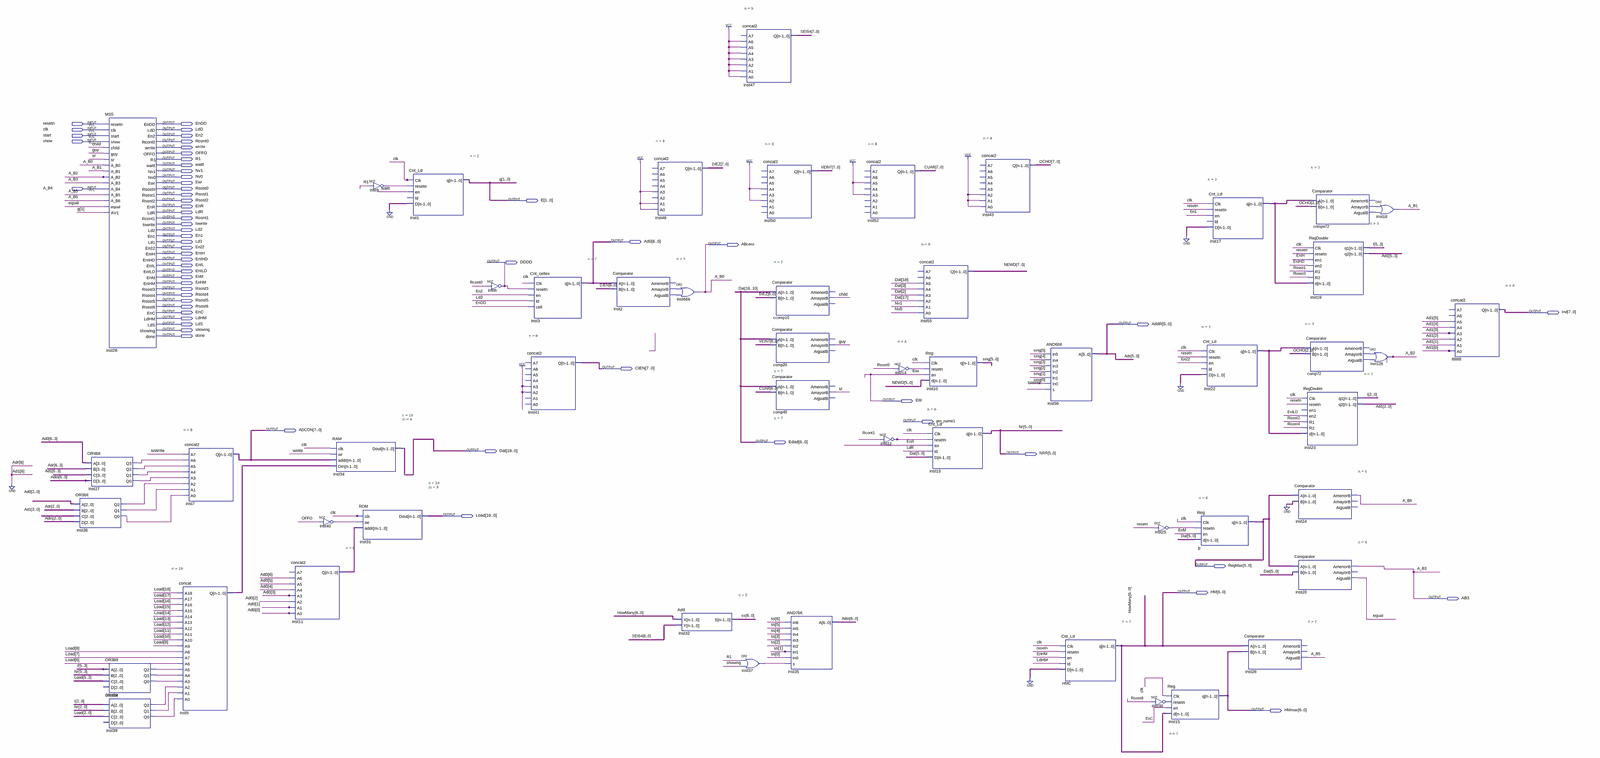
[diagram p0: schematic sheet, whole]
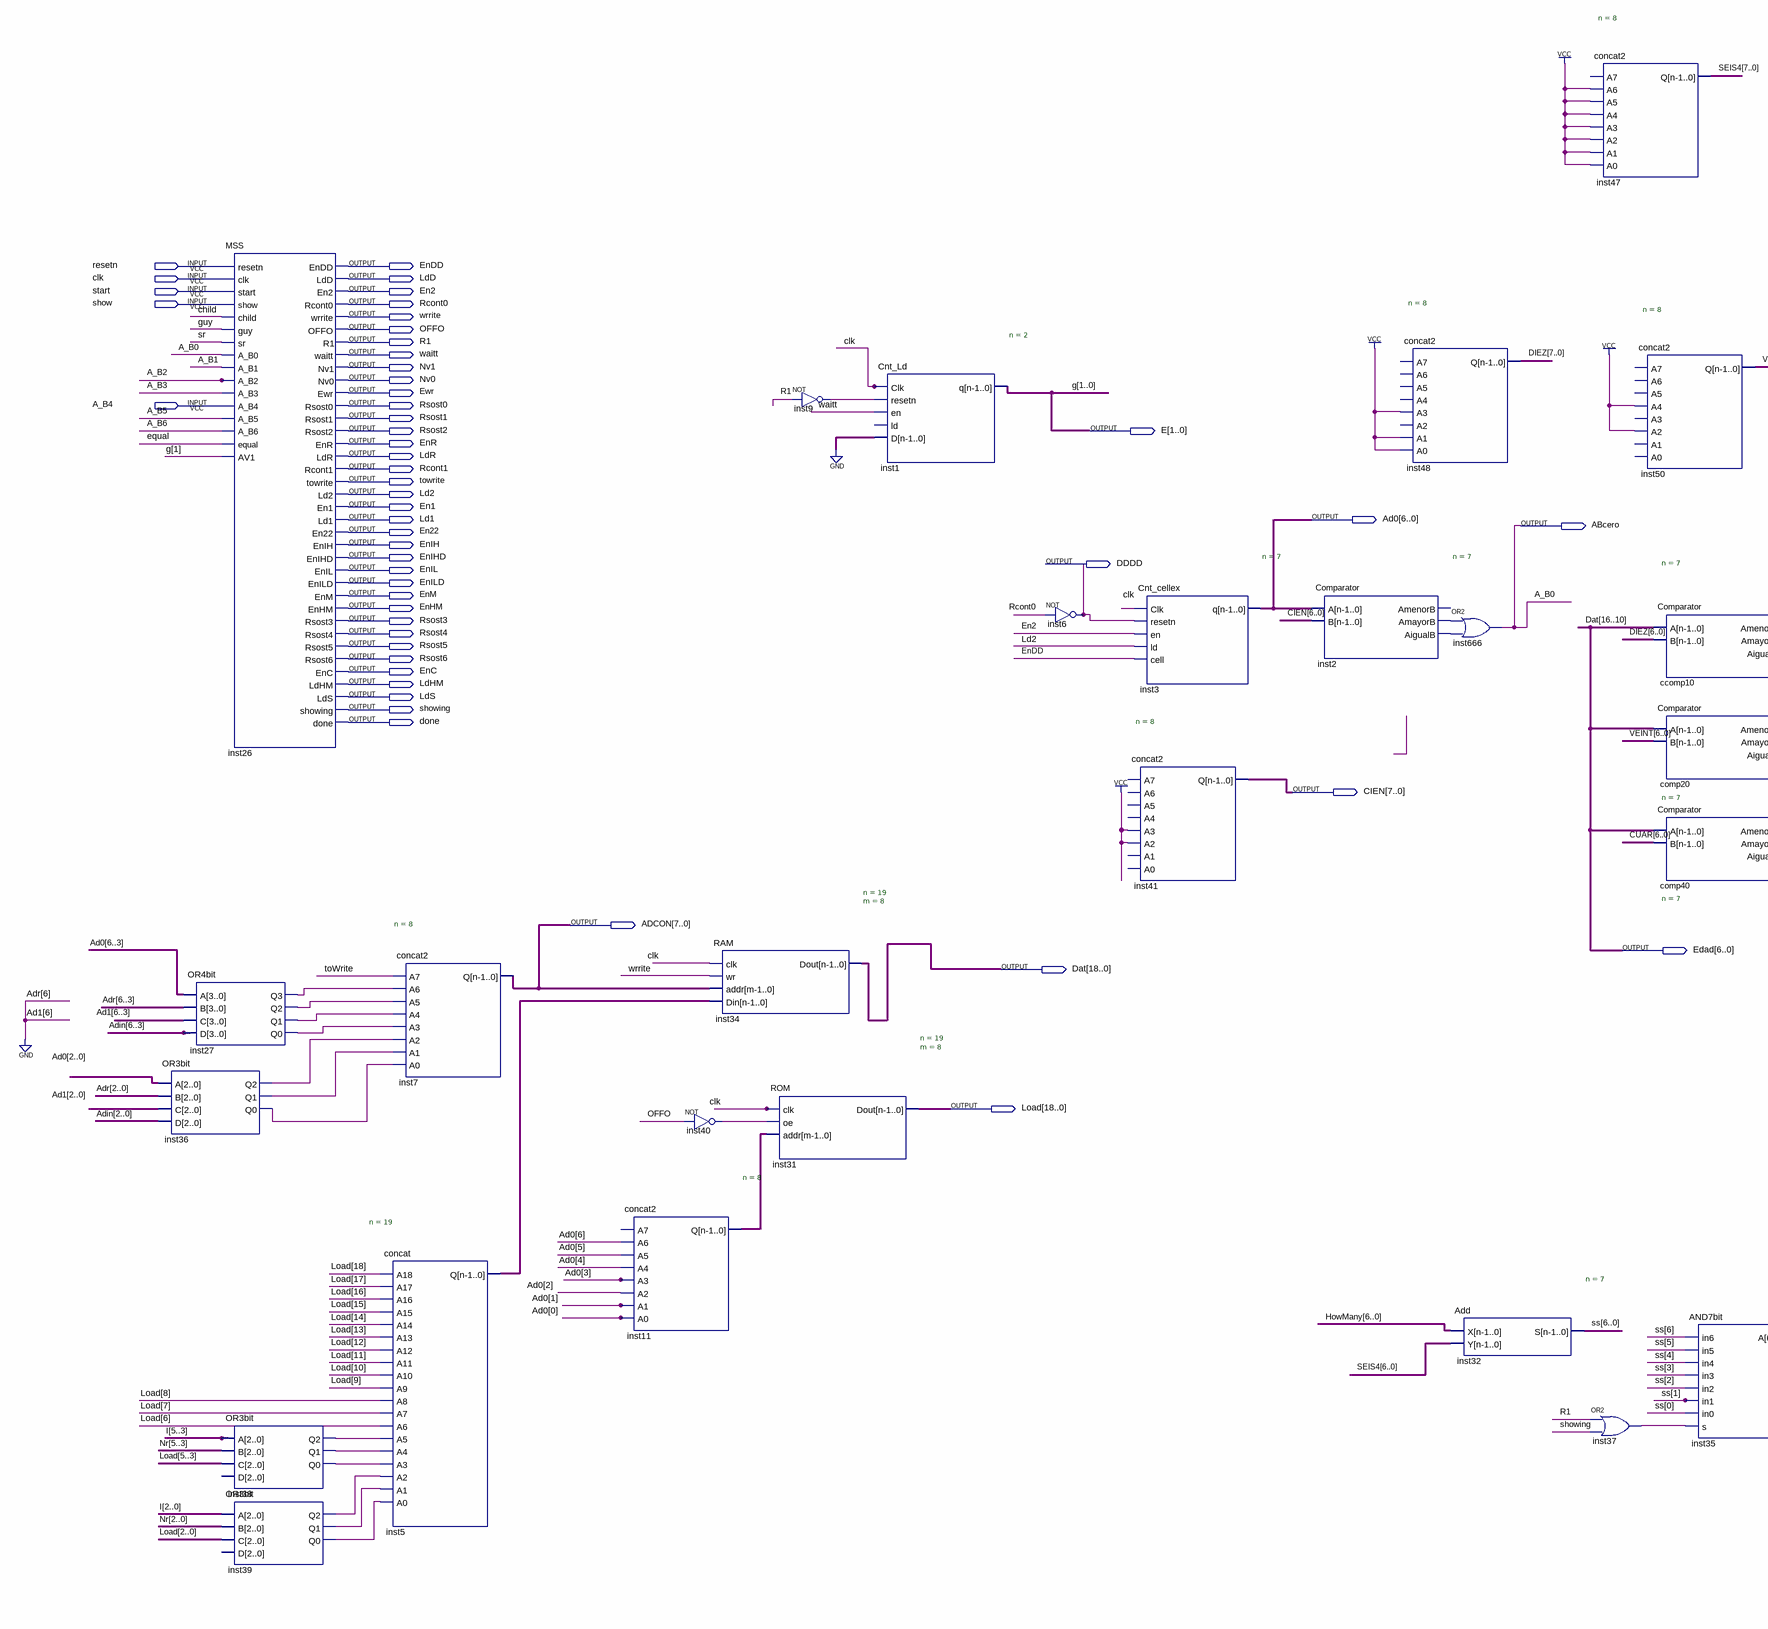
[diagram p1: schematic sheet, left part]
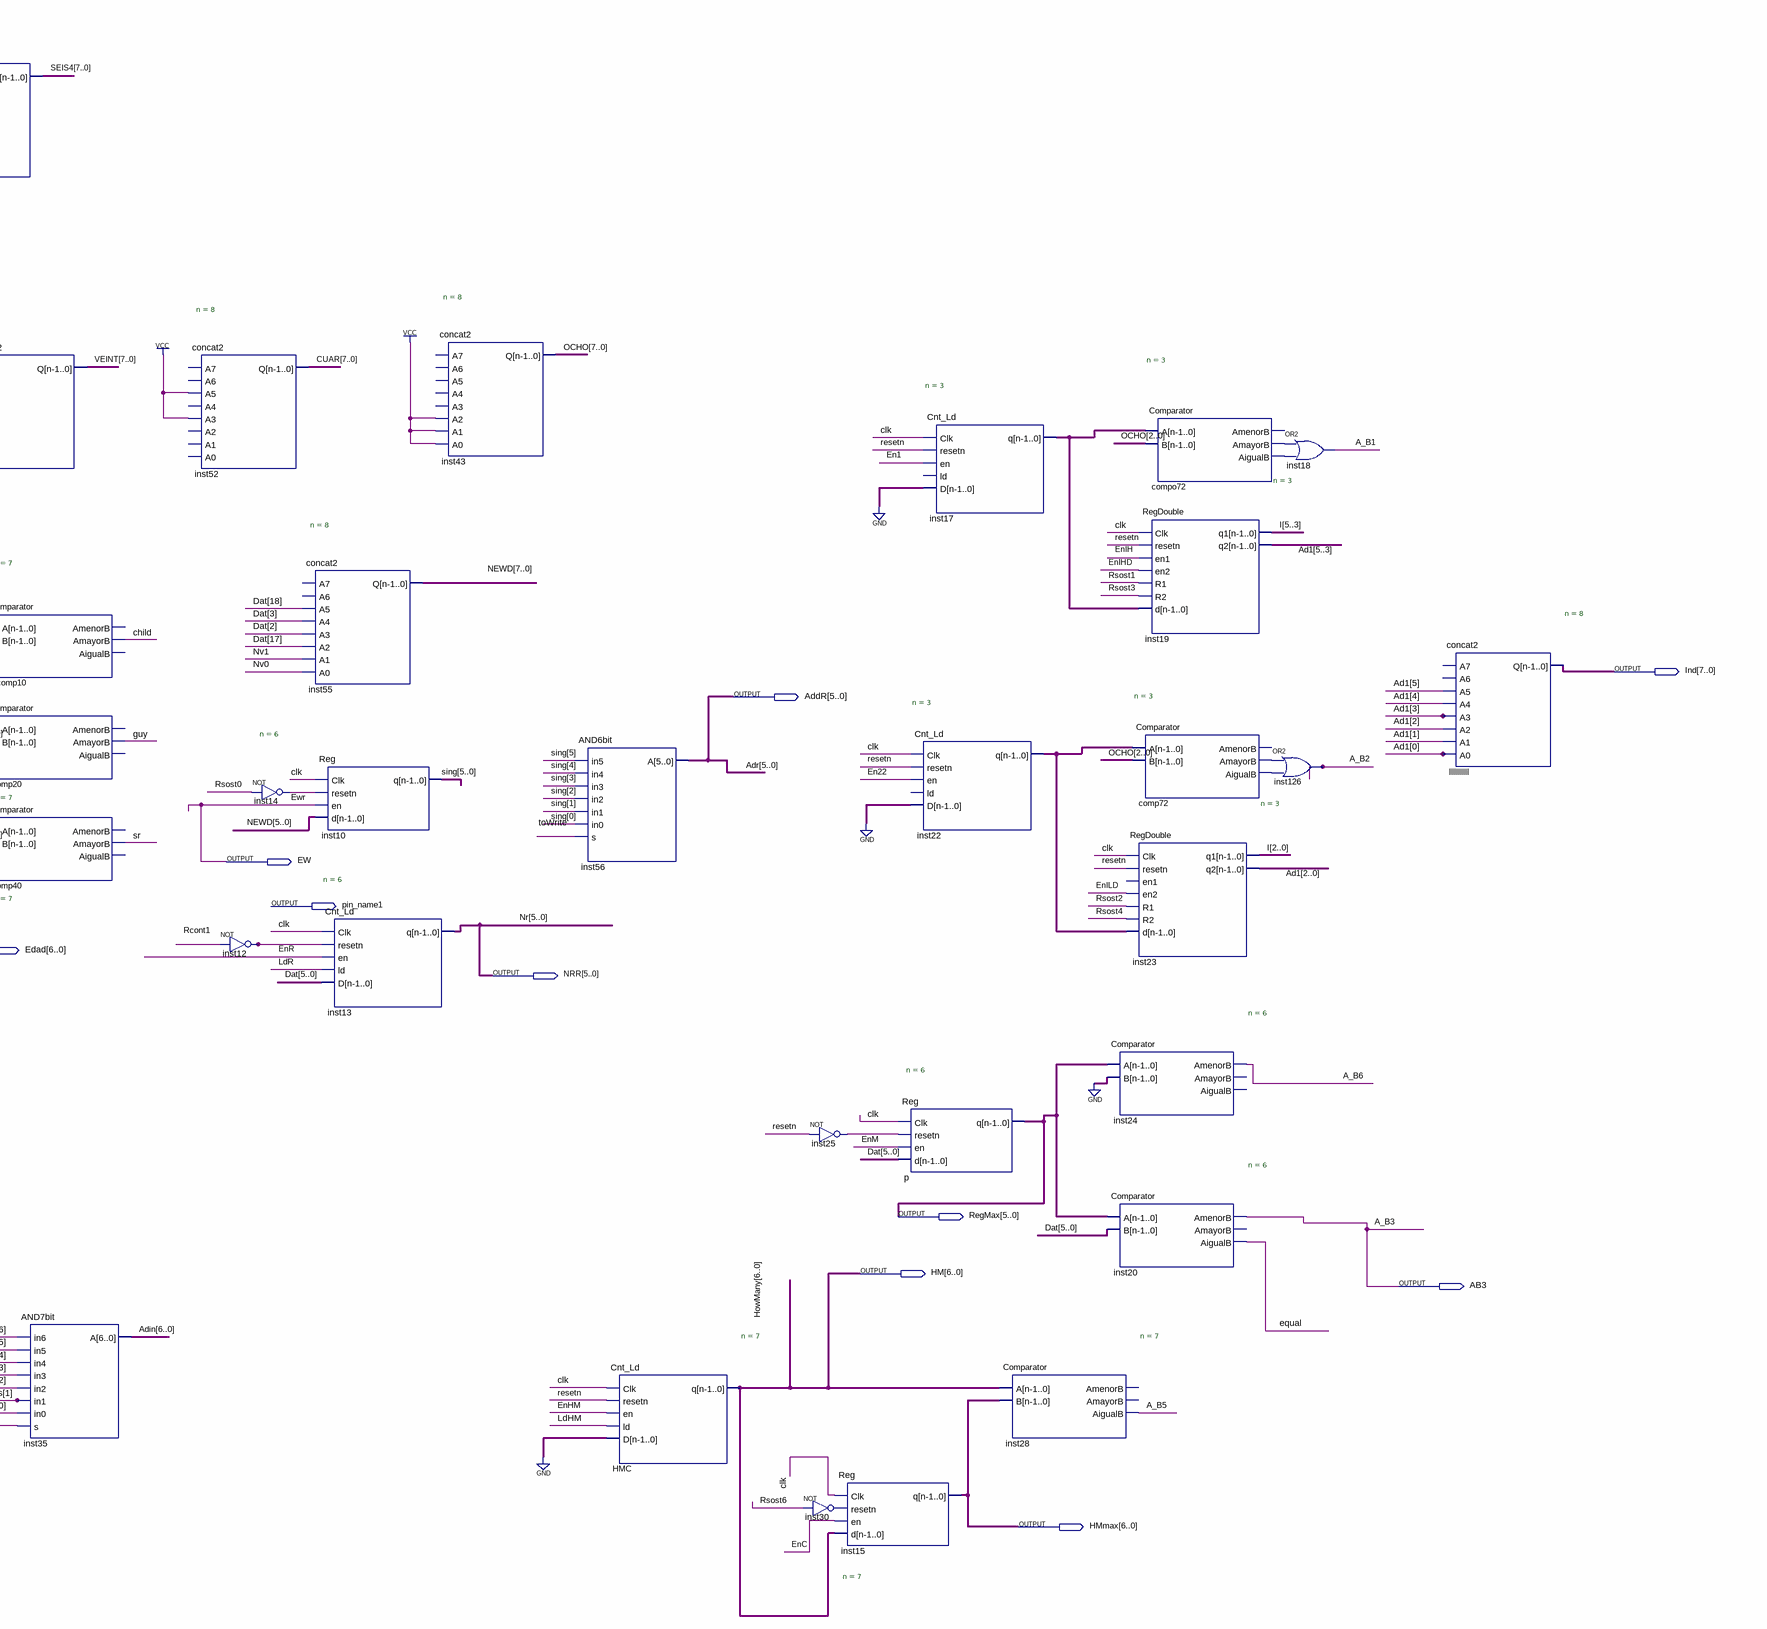
[diagram p2: schematic sheet, right part]
// Quartus schematic Block1.bdf as structural Verilog: 52 symbols, 60 pins
module Block1 (
  input  resetn,
  input  clk,
  input  start,
  input  show,
  input  A_B4,
  output EnDD,
  output LdD,
  output En2,
  output Rcont0,
  output wrrite,
  output OFFO,
  output R1,
  output waitt,
  output Nv1,
  output Nv0,
  output Ewr,
  output Rsost0,
  output Rsost1,
  output Rsost2,
  output [1:0] E,
  output EnR,
  output LdR,
  output Rcont1,
  output towrite,
  output Ld2,
  output En1,
  output Ld1,
  output [6:0] Ad0,
  output ABcero,
  output En22,
  output EnIH,
  output EnIHD,
  output DDDD,
  output EnIL,
  output EnILD,
  output EnM,
  output EnHM,
  output Rsost3,
  output Rsost4,
  output Rsost5,
  output Rsost6,
  output EnC,
  output [7:0] Ind,
  output LdHM,
  output LdS,
  output [5:0] AddR,
  output showing,
  output done,
  output [7:0] CIEN,
  output EW,
  output pin_name1,
  output [7:0] ADCON,
  output [6:0] Edad,
  output [18:0] Dat,
  output [5:0] NRR,
  output [18:0] Load,
  output [5:0] RegMax,
  output [6:0] HM,
  output AB3,
  output [6:0] HMmax
);

  wire A_B1, A_B2, A_B5, A_B6, child, comp72_aigualb, comp72_amayorb, compo72_aigualb, compo72_amayorb,
       equal, guy, inst2_aigualb, inst2_amayorb, inst9_out, inst12_out, inst14_out, inst25_out, inst27_q0,
       inst27_q1, inst27_q2, inst27_q3, inst30_out, inst36_q0, inst36_q1, inst36_q2, inst37_out, inst38_q0,
       inst38_q1, inst38_q2, inst39_q0, inst39_q1, inst39_q2, inst40_out, sr;
  wire [2:0] inst17_q, inst22_q;
  wire [5:0] Ad1, I, sing;
  wire [6:0] Adin, ss;
  wire [7:0] CUAR, DIEZ, inst11_q, NEWD, OCHO, SEIS4, VEINT;
  wire [18:0] inst5_q;

  OR3bit inst36 (
    .A(Ad0[2:0]), .B(AddR[2:0]), .C(Ad1[2:0]), .D(Adin[2:0]), .Q2(inst36_q2), .Q1(inst36_q1), .Q0(inst36_q0));
  OR4bit inst27 (
    .A(Ad0[6:3]), .B({1'b0, AddR[5:3]}), .C({1'b0, Ad1[5:3]}), .D(Adin[6:3]), .Q3(inst27_q3), .Q2(inst27_q2),
    .Q1(inst27_q1), .Q0(inst27_q0));
  MSS inst26 (
    .resetn(resetn), .clk(clk), .start(start), .show(show), .child(child), .guy(guy), .sr(sr), .A_B0(ABcero),
    .A_B1(A_B1), .A_B2(A_B2), .A_B3(AB3), .A_B4(A_B4), .A_B5(A_B5), .A_B6(A_B6), .equal(equal), .AV1(E[1]),
    .EnDD(EnDD), .LdD(LdD), .En2(En2), .Rcont0(Rcont0), .wrrite(wrrite), .OFFO(OFFO), .R1(R1), .waitt(waitt),
    .Nv1(Nv1), .Nv0(Nv0), .Ewr(EW), .Rsost0(Rsost0), .Rsost1(Rsost1), .Rsost2(Rsost2), .EnR(EnR), .LdR(LdR),
    .Rcont1(Rcont1), .towrite(towrite), .Ld2(Ld2), .En1(En1), .Ld1(Ld1), .En22(En22), .EnIH(EnIH),
    .EnIHD(EnIHD), .EnIL(EnIL), .EnILD(EnILD), .EnM(EnM), .EnHM(EnHM), .Rsost3(Rsost3), .Rsost4(Rsost4),
    .Rsost5(Rsost5), .Rsost6(Rsost6), .EnC(EnC), .LdHM(LdHM), .LdS(LdS), .showing(showing), .done(done));
  OR3bit inst38 (.A(I[5:3]), .B(NRR[5:3]), .C(Load[5:3]), .Q2(inst38_q2), .Q1(inst38_q1), .Q0(inst38_q0));  // open: D
  OR3bit inst39 (.A(I[2:0]), .B(NRR[2:0]), .C(Load[2:0]), .Q2(inst39_q2), .Q1(inst39_q1), .Q0(inst39_q0));  // open: D
  concat2 #(.n(8)) inst7 (
    .A7(towrite), .A6(inst27_q3), .A5(inst27_q2), .A4(inst27_q1), .A3(inst27_q0), .A2(inst36_q2),
    .A1(inst36_q1), .A0(inst36_q0), .Q(ADCON));
  concat #(.n(19)) inst5 (
    .A18(Load[18]), .A17(Load[17]), .A16(Load[16]), .A15(Load[15]), .A14(Load[14]), .A13(Load[13]),
    .A12(Load[12]), .A11(Load[11]), .A10(Load[10]), .A9(Load[9]), .A8(Load[8]), .A7(Load[7]), .A6(Load[6]),
    .A5(inst38_q2), .A4(inst38_q1), .A3(inst38_q0), .A2(inst39_q2), .A1(inst39_q1), .A0(inst39_q0),
    .Q(inst5_q));
  concat2 #(.n(8)) inst11 (
    .A6(Ad0[6]), .A5(Ad0[5]), .A4(Ad0[4]), .A3(Ad0[3]), .A2(Ad0[2]), .A1(Ad0[1]), .A0(Ad0[0]), .Q(inst11_q));  // open: A7
  RAM #(.n(19), .m(8)) inst34 (.clk(clk), .wr(wrrite), .addr(ADCON), .Din(inst5_q), .Dout(Dat));
  not inst40 (inst40_out, OFFO);
  ROM #(.n(19), .m(8)) inst31 (.clk(clk), .oe(inst40_out), .addr(inst11_q), .Dout(Load));
  not inst9 (inst9_out, R1);
  Cnt_Ld #(.n(2)) inst1 (.Clk(clk), .resetn(inst9_out), .en(waitt), .D(2'b00), .q(E));  // open: ld
  not inst6 (DDDD, Rcont0);
  concat2 #(.n(8)) inst41 (.A3(1'b1), .A2(1'b1), .Q(CIEN));  // open: A7, A6, A5, A4, A1, A0
  Cnt_cellex #(.n(7)) inst3 (.Clk(clk), .resetn(DDDD), .en(En2), .ld(Ld2), .\cell (EnDD), .q(Ad0));
  Comparator #(.n(7)) inst2 (
    .A(Ad0), .B(CIEN[6:0]), .AmayorB(inst2_amayorb), .AigualB(inst2_aigualb));  // open: AmenorB
  concat2 #(.n(8)) inst48 (.A3(1'b1), .A1(1'b1), .A0(1'b1), .Q(DIEZ));  // open: A7, A6, A5, A4, A2
  or inst666 (ABcero, inst2_amayorb, inst2_aigualb);
  Add #(.n(7)) inst32 (.X(HM), .Y(SEIS4[6:0]), .S(ss));
  concat2 #(.n(8)) inst47 (
    .A6(1'b1), .A5(1'b1), .A4(1'b1), .A3(1'b1), .A2(1'b1), .A1(1'b1), .A0(1'b1), .Q(SEIS4));  // open: A7
  concat2 #(.n(8)) inst50 (.A4(1'b1), .A2(1'b1), .Q(VEINT));  // open: A7, A6, A5, A3, A1, A0
  or inst37 (inst37_out, R1, showing);
  Comparator #(.n(7)) ccomp10 (.A(Dat[16:10]), .B(DIEZ[6:0]), .AmayorB(child));  // open: AmenorB, AigualB
  Comparator #(.n(7)) comp20 (.A(Dat[16:10]), .B(VEINT[6:0]), .AmayorB(guy));  // open: AmenorB, AigualB
  Comparator #(.n(7)) comp40 (.A(Dat[16:10]), .B(CUAR[6:0]), .AmayorB(sr));  // open: AmenorB, AigualB
  AND7bit inst35 (
    .in6(ss[6]), .in5(ss[5]), .in4(ss[4]), .in3(ss[3]), .in2(ss[2]), .in1(ss[1]), .in0(ss[0]),
    .s(inst37_out), .A(Adin));
  concat2 #(.n(8)) inst52 (.A5(1'b1), .A3(1'b1), .Q(CUAR));  // open: A7, A6, A4, A2, A1, A0
  not inst12 (inst12_out, Rcont1);
  not inst14 (inst14_out, Rsost0);
  concat2 #(.n(8)) inst55 (
    .A5(Dat[18]), .A4(Dat[3]), .A3(Dat[2]), .A2(Dat[17]), .A1(Nv1), .A0(Nv0), .Q(NEWD));  // open: A7, A6
  Reg #(.n(6)) inst10 (.Clk(clk), .resetn(inst14_out), .en(EW), .d(NEWD[5:0]), .q(sing));
  Cnt_Ld #(.n(6)) inst13 (.Clk(clk), .resetn(inst12_out), .en(EnR), .ld(LdR), .D(Dat[5:0]), .q(NRR));
  concat2 #(.n(8)) inst43 (.A2(1'b1), .A1(1'b1), .A0(1'b1), .Q(OCHO));  // open: A7, A6, A5, A4, A3
  AND6bit inst56 (
    .in5(sing[5]), .in4(sing[4]), .in3(sing[3]), .in2(sing[2]), .in1(sing[1]), .in0(sing[0]), .s(towrite),
    .A(AddR));
  Cnt_Ld #(.n(7)) HMC (.Clk(clk), .resetn(resetn), .en(EnHM), .ld(LdHM), .D({7{1'b0}}), .q(HM));
  not inst25 (inst25_out, resetn);
  not inst30 (inst30_out, Rsost6);
  Reg #(.n(7)) inst15 (.Clk(clk), .resetn(inst30_out), .en(EnC), .d(HM), .q(HMmax));
  Cnt_Ld #(.n(3)) inst17 (.Clk(clk), .resetn(resetn), .en(En1), .D(3'b000), .q(inst17_q));  // open: ld
  Cnt_Ld #(.n(3)) inst22 (.Clk(clk), .resetn(resetn), .en(En22), .D(3'b000), .q(inst22_q));  // open: ld
  Reg #(.n(6)) p (.Clk(clk), .resetn(inst25_out), .en(EnM), .d(Dat[5:0]), .q(RegMax));
  Comparator #(.n(7)) inst28 (.A(HM), .B(HMmax), .AigualB(A_B5));  // open: AmenorB, AmayorB
  Comparator #(.n(3)) comp72 (
    .A(inst22_q), .B(OCHO[2:0]), .AmayorB(comp72_amayorb), .AigualB(comp72_aigualb));  // open: AmenorB
  RegDouble #(.n(3)) inst23 (
    .Clk(clk), .resetn(resetn), .en2(EnILD), .R1(Rsost2), .R2(Rsost4), .d(inst22_q), .q1(I[2:0]),
    .q2(Ad1[2:0]));  // open: en1
  Comparator #(.n(6)) inst24 (.A(RegMax), .B({6{1'b0}}), .AmenorB(A_B6));  // open: AmayorB, AigualB
  Comparator #(.n(6)) inst20 (.A(RegMax), .B(Dat[5:0]), .AmenorB(AB3), .AigualB(equal));  // open: AmayorB
  Comparator #(.n(3)) compo72 (
    .A(inst17_q), .B(OCHO[2:0]), .AmayorB(compo72_amayorb), .AigualB(compo72_aigualb));  // open: AmenorB
  RegDouble #(.n(3)) inst19 (
    .Clk(clk), .resetn(resetn), .en1(EnIH), .en2(EnIHD), .R1(Rsost1), .R2(Rsost3), .d(inst17_q), .q1(I[5:3]),
    .q2(Ad1[5:3]));
  or inst18 (A_B1, compo72_amayorb, compo72_aigualb);
  or inst126 (A_B2, comp72_amayorb, comp72_aigualb);
  concat2 #(.n(8)) llllllllll (
    .A5(Ad1[5]), .A4(Ad1[4]), .A3(Ad1[3]), .A2(Ad1[2]), .A1(Ad1[1]), .A0(Ad1[0]), .Q(Ind));  // open: A7, A6

  assign Edad = Dat[16:10];
  assign Ewr = EW;

  // Other names for the same wires on the sheet: A_B3 = AB3; A_B0 = ABcero; Adr[5:0] = AddR; g[1:0] = E;
  //   HowMany[6:0] = HM; Nr[5:0] = NRR
endmodule
